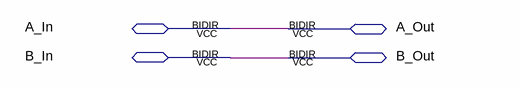
[diagram p0: schematic sheet]
// Quartus schematic I2C_Buff.bdf as structural Verilog: 0 symbols, 4 pins
module I2C_Buff (
  inout  A_In,
  inout  A_Out,
  inout  B_In,
  inout  B_Out
);


  assign A_Out = A_In;
  assign B_Out = B_In;
endmodule
